# EAGLE schematic radio_module (EAGLE 6.6.0)
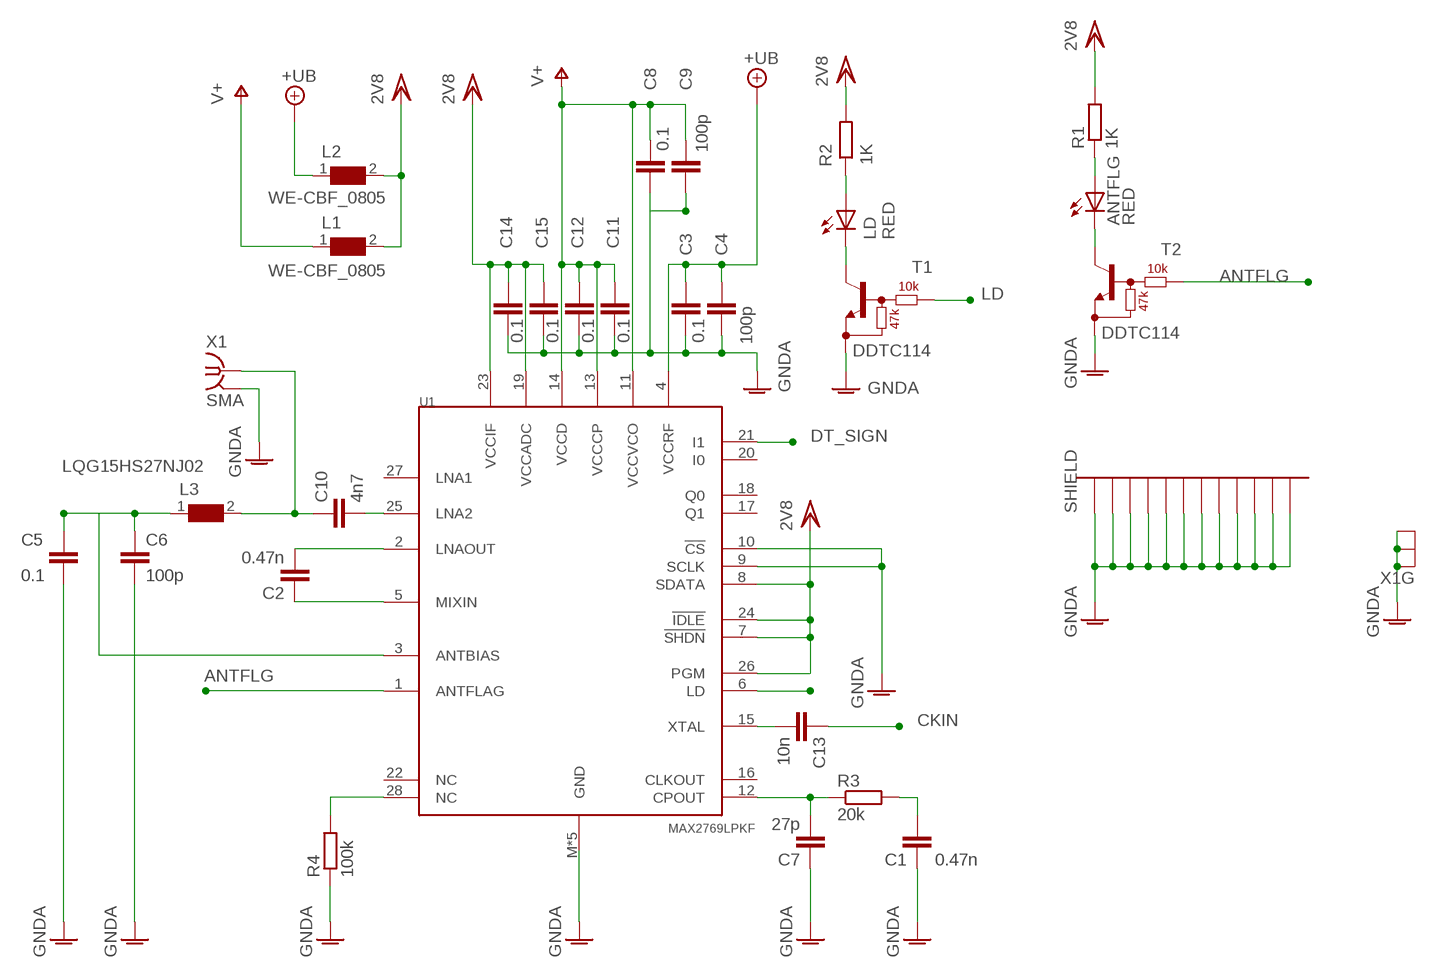
[diagram p0: schematic, sheet 1]

## Parts
ANTFLG  RED  LEDCHIP-LED0603  [CHIP-LED0603]
C1  0.47n  C-EUC0402  [C0402]
C2  0.47n  C-EUC0402  [C0402]
C3  0.1  C-EUC0402  [C0402]
C4  100p  C-EUC0402  [C0402]
C5  0.1  C-EUC0603  [C0603]
C6  100p  C-EUC0402  [C0402]
C7  27p  C-EUC0402  [C0402]
C8  0.1  C-EUC0402  [C0402]
C9  100p  C-EUC0402  [C0402]
C10  4n7  C-EUC0402  [C0402]
C11  0.1  C-EUC0402  [C0402]
C12  0.1  C-EUC0402  [C0402]
C13  10n  C-EUC0402  [C0402]
C14  0.1  C-EUC0402  [C0402]
C15  0.1  C-EUC0402  [C0402]
L1  WE-CBF_0805  [0805]
L2  WE-CBF_0805  [0805]
L3  LQG15HS27NJ02  WE-MK_0402  [0402]
LD  RED  LEDCHIP-LED0603  [CHIP-LED0603]
R1  1K  R-EU_R0402  [R0402]
R2  1K  R-EU_R0402  [R0402]
R3  20k  R-EU_R0402  [R0402]
R4  100k  R-EU_R0402  [R0402]
S2  BMIS-202  [BMIS-202]
T1  DDTC114  BCR135W  [SOT323-R_INFINEON]
T2  DDTC114  BCR135W  [SOT323-R_INFINEON]
U1  MAX2769LPKF  [QFN28LPKF]
X1  SMA  SMA-142-0701-801/806  [J502-ND-142-0701-801/806]

## Nets
+UB: C3.1 C4.1 L2.1 U1.4(VCCRF)
ANTFLG: T2.1(B) U1.1(ANTFLAG)
CKIN: C13.1
DT_SIGN: U1.21(I1)
GNDA: C1.1 C3.2 C4.2 C5.2 C6.2 C7.1 C8.2 C9.2 C11.2 C12.2 C14.2 C15.2 R4.1 S2.P$1(GND) S2.P$2(GND) S2.P$3(GND) S2.P$4(GND) S2.P$5(GND) S2.P$6(GND) S2.P$7(GND) S2.P$8(GND) S2.P$9(GND) S2.P$10(GND) S2.P$11(GND) S2.P$12(GND) T1.2(E) T2.2(E) U1.9(SCLK) U1.10(!CS) U1.M(GND) U1.P$4(GND) U1.P$6(GND) U1.P$7(GND) U1.P$9(GND) X1.G@1(GND) X1.G@2(GND) X1.G@3(GND) X1.G@4(GND)
LD: T1.1(B) U1.6(LD)
LNA2: C10.2 U1.25(LNA2)
LNAOUT: C2.2 U1.2(LNAOUT)
MIXIN: C2.1 U1.5(MIXIN)
N$1: C7.2 R3.1 U1.12(CPOUT)
N$3: C1.2 R3.2
N$5: C5.1 C6.1 L3.1 U1.3(ANTBIAS)
N$7: ANTFLG.A R1.1
N$8: ANTFLG.C T2.3(C)
N$16: LD.A R2.1
N$17: LD.C T1.3(C)
N$18: R4.2 U1.28(NC)
N$33: C10.1 L3.2 X1.1
V+: C8.1 C9.1 C11.1 C12.1 L1.1 U1.11(VCCVCO) U1.13(VCCCP) U1.14(VCCD)
VCC/2: C14.1 C15.1 L1.2 L2.2 R1.2 R2.2 U1.7(!SHDN) U1.8(SDATA) U1.19(VCCADC) U1.23(VCCIF) U1.24(!IDLE) U1.26(PGM) ; supply symbol labelled 2V8
XTAL: C13.2 U1.15(XTAL)
Unconnected: U1.16(CLKOUT) U1.17(Q1) U1.18(Q0) U1.20(I0) U1.22(NC) U1.27(LNA1)

## Library data of the parts
ANTFLG LD = led:LED: LED OSRAM: - CHIPLED LG R971, LG N971, LY N971, LG Q971, LY Q971, LO R971, LY R971 LH N974, LH R974 LS Q976, LO Q976, LY Q976 LO Q996 - Hyper CHIPLED LW Q18S LB Q993, LB Q99A, LB R99A - SideLED LS A670, LO A670, LY A670, LG A670, LP A670 LB A673, LV A673, LT A673, LW A673 LH A674 LY A675 LS A676, LA A676, LO A676, LY A676, LW A676 LS A679, LY A679, LG A679 - Hyper Micro SIDELED® LS Y876, LA Y876, LO Y876, LY Y876 LT Y87S - SmartLED LW L88C, LW L88S LB L89C, LB L89S, LG L890 LS L89K, LO L89K, LY L89K LS L896, LA L896, LO L896, LY L896 - TOPLED LS T670, LO T670, LY T670, LG T670, LP T670 LSG T670, LSP T670, LSY T670, LOP T670, LYG T670 LG T671, LOG T671, LSG T671 LB T673, LV T673, LT T673, LW T673 LH T674 LS T676, LA T676, LO T676, LY T676, LB T676, LH T676, LSB T676, LW T676 LB T67C, LV T67C, LT T67C, LS T67K, LO T67K, LY T67K, LW E67C LS E67B, LA E67B, LO E67B, LY E67B, LB E67C, LV E67C, LT E67C LW T67C LS T679, LY T679, LG T679 LS T770, LO T770, LY T770, LG T770, LP T770 LB T773, LV T773, LT T773, LW T773 LH T774 LS E675, LA E675, LY E675, LS T675 LS T776, LA T776, LO T776, LY T776, LB T776 LHGB T686 LT T68C, LB T68C - Hyper Mini TOPLED® LB M676 - Mini TOPLED Santana® LG M470 LS M47K, LO M47K, LY M47K Source: http://www.osram.convergy.de LUXEON: - LUMILED® LXK2-PW12-R00, LXK2-PW12-S00, LXK2-PW14-U00, LXK2-PW14-V00 LXK2-PM12-R00, LXK2-PM12-S00, LXK2-PM14-U00 LXK2-PE12-Q00, LXK2-PE12-R00, LXK2-PE12-S00, LXK2-PE14-T00, LXK2-PE14-U00 LXK2-PB12-K00, LXK2-PB12-L00, LXK2-PB12-M00, LXK2-PB14-N00, LXK2-PB14-P00, LXK2-PB14-Q00 LXK2-PR12-L00, LXK2-PR12-M00, LXK2-PR14-Q00, LXK2-PR14-R00 LXK2-PD12-Q00, LXK2-PD12-R00, LXK2-PD12-S00 LXK2-PH12-R00, LXK2-PH12-S00 LXK2-PL12-P00, LXK2-PL12-Q00, LXK2-PL12-R00 Source: www.luxeon.com KINGBRIGHT: KA-3528ASYC Source: www.kingbright.com
C1-C4 C6-C15 = rcl_1:C-EU: CAPACITOR, European symbol
C5 = rcl:C-EU: CAPACITOR, European symbol
L1 L2 = EagleLibrary_Wuerth_Elektronik_eiSos_Version_6-9:WE-CBF: SMD EMI Suppression Ferrite Beads WE-CBF - Excellent anti-EMI properties - Low DC-restistance - Impedances till 3000 ohms - Rated current up to 6 A -- Reliable Ni-Sn electrodes -- Perfect as data lined filter and for uncoupling of distribution voltage
L3 = wuerth_elektronik_eisos__v6.12:WE-MK: SMD Multilayer Ceramic Inductors WE-MK - Windings printed on ceramic substrate - Extremely high SRF > 15 GHz - Inductance is stable over temperature -- High frequency circuits -- Bluetooth -- Wireless LAN -- Filter circuits
R1-R4 = rcl:R-EU_: RESISTOR, European symbol
S2 = laird:BMIS-202: Laird BMI-S-202 EMI Shield
T1 T2 = digital-transistors-2:BCR135: NPN Silicon Digital Transistor 50V 0,1A 0,2W
U1 = maxim1:MAX2769: Universal GPS Receiver
X1 = con-coax:SMA-: SMA 50 Ohm End Launch Jack Receptacle - Round Contact Johnson Components Source: www.johnsoncomponents.com .. J502-ND.pdf; MF: JOHNSON COMPONENTS; MPN: 142-0701-801; OC_FARNELL: 1608592; OC_NEWARK: 90F2624